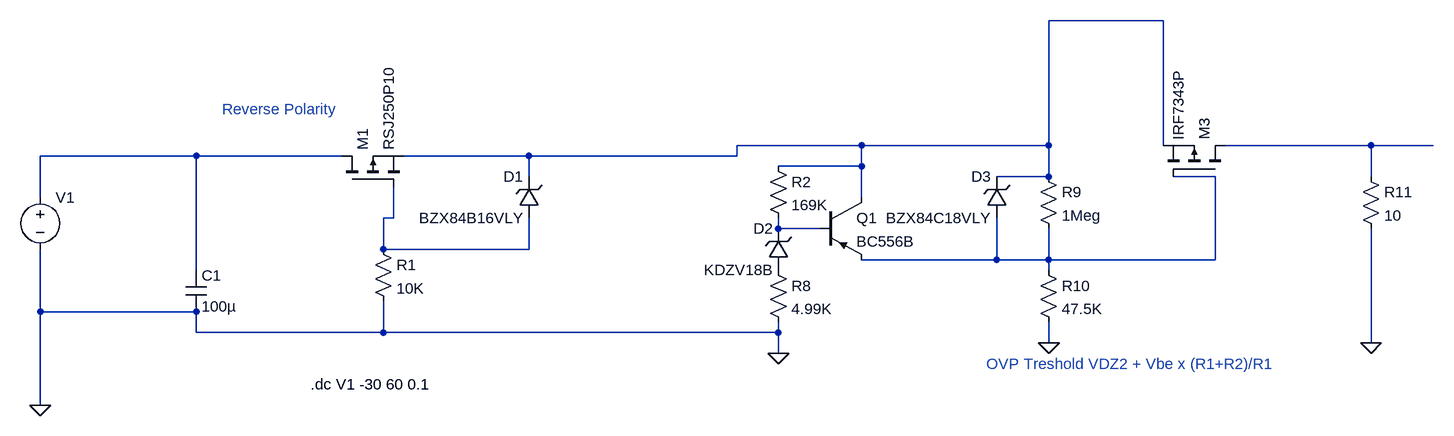
[diagram p0: schematic ReversePolarityAndOvervoltageProtection.asc]
ReversePolarityAndOvervoltageProtection.asc, the LTspice schematic file:
Version 4.1
SHEET 1 3768 680
WIRE 1776 -208 1600 -208
WIRE 1312 -16 1120 -16
WIRE 1600 -16 1600 -208
WIRE 1600 -16 1312 -16
WIRE 1776 -16 1776 -208
WIRE 2096 -16 1872 -16
WIRE 2192 -16 2096 -16
WIRE 288 0 48 0
WIRE 512 0 288 0
WIRE 800 0 608 0
WIRE 1120 0 1120 -16
WIRE 1120 0 800 0
WIRE 1312 16 1312 -16
WIRE 1312 16 1184 16
WIRE 800 32 800 0
WIRE 1600 32 1600 -16
WIRE 1600 32 1520 32
WIRE 1856 32 1792 32
WIRE 2096 32 2096 -16
WIRE 48 64 48 0
WIRE 1312 64 1312 16
WIRE 592 96 592 48
WIRE 592 96 576 96
WIRE 1184 112 1184 96
WIRE 1248 112 1184 112
WIRE 576 144 576 96
WIRE 800 144 800 96
WIRE 800 144 576 144
WIRE 1520 160 1520 96
WIRE 1520 160 1312 160
WIRE 1600 160 1600 112
WIRE 1600 160 1520 160
WIRE 1856 160 1856 32
WIRE 1856 160 1600 160
WIRE 288 176 288 0
WIRE 1600 176 1600 160
WIRE 48 240 48 144
WIRE 288 240 48 240
WIRE 288 272 288 240
WIRE 576 272 576 224
WIRE 576 272 288 272
WIRE 1184 272 1184 256
WIRE 1184 272 576 272
WIRE 1600 288 1600 256
WIRE 2096 288 2096 112
WIRE 1184 304 1184 272
WIRE 48 384 48 240
FLAG 48 384 0
FLAG 1184 304 0
FLAG 1600 288 0
FLAG 2096 288 0
SYMBOL voltage 48 48 R0
WINDOW 123 0 0 Left 0
WINDOW 39 0 0 Left 0
SYMATTR InstName V1
SYMATTR Value ""
SYMBOL res 560 128 R0
SYMATTR InstName R1
SYMATTR Value 10K
SYMATTR SpiceLine tol=1 pwr=0.1
SYMBOL zener 816 96 R180
WINDOW 0 24 64 Left 2
WINDOW 3 24 0 Left 2
SYMATTR InstName D1
SYMATTR Value BZX84B16VLY
SYMBOL cap 272 176 R0
SYMATTR Value 100µ
SYMATTR InstName C1
SYMATTR SpiceLine V=35 Irms=150m Rser=0.135 Lser=1.5n mfg="W�rth Elektronik" pn="865230557006 WCAP-AS5H 10x10,5" type="Al electrolytic"
SYMBOL pmos 512 48 R270
SYMATTR InstName M1
SYMATTR Value RSJ250P10
SYMBOL res 1168 0 R0
SYMATTR InstName R2
SYMATTR Value 169K
SYMATTR SpiceLine tol=1 pwr=0.1
SYMBOL res 1168 160 R0
SYMATTR InstName R8
SYMATTR Value 4.99K
SYMATTR SpiceLine tol=1 pwr=0.1
SYMBOL pnp 1248 64 R0
SYMATTR InstName Q1
SYMATTR Value BC556B
SYMBOL res 1584 16 R0
SYMATTR InstName R9
SYMATTR Value 1Meg
SYMATTR SpiceLine tol=1 pwr=0.1
SYMBOL res 1584 160 R0
SYMATTR InstName R10
SYMATTR Value 47.5K
SYMATTR SpiceLine tol=1 pwr=0.1
SYMBOL res 2080 16 R0
SYMATTR InstName R11
SYMATTR Value 10
SYMATTR SpiceLine tol=1 pwr=0.1
SYMBOL zener 1200 176 R180
WINDOW 0 24 64 Left 2
WINDOW 3 24 0 Left 2
SYMATTR InstName D2
SYMATTR Value KDZV18B
SYMBOL zener 1536 96 R180
WINDOW 0 24 64 Left 2
WINDOW 3 24 0 Left 2
SYMATTR InstName D3
SYMATTR Value BZX84C18VLY
SYMBOL pmos 1872 32 M270
SYMATTR InstName M3
SYMATTR Value IRF7343P
TEXT 464 352 Left 2 !.dc V1 -30 60 0.1
TEXT 328 -72 Left 2 ;Reverse Polarity
TEXT 1504 320 Left 2 ;OVP Treshold VDZ2 + Vbe x (R1+R2)/R1

The netlist it stands for:
* ReversePolarityAndOvervoltageProtection.asc
V1 N003 0
R1 N005 0 10K tol=1 pwr=0.1
D1 N005 N001 BZX84B16VLY
C1 N003 0 100µ V=35 Irms=150m Rser=0.135 Lser=1.5n mfg="W�rth Elektronik" pn="865230557006 WCAP-AS5H 10x10,5" type="Al electrolytic"
M1 N003 N005 N001 N001 RSJ250P10
R2 N001 N006 169K tol=1 pwr=0.1
R8 P001 0 4.99K tol=1 pwr=0.1
Q1 N001 N006 N004 0 BC556B
R9 N001 N004 1Meg tol=1 pwr=0.1
R10 N004 0 47.5K tol=1 pwr=0.1
R11 N002 0 10 tol=1 pwr=0.1
D2 P001 N006 KDZV18B
D3 N004 N001 BZX84C18VLY
M3 N002 N004 N001 N001 IRF7343P
.model D D
.lib standard.dio
.model NPN NPN
.model PNP PNP
.lib standard.bjt
.model NMOS NMOS
.model PMOS PMOS
.lib standard.mos
.dc V1 -30 60 0.1
* Reverse Polarity
* OVP Treshold VDZ2 + Vbe x (R1+R2)/R1
.backanno
.end